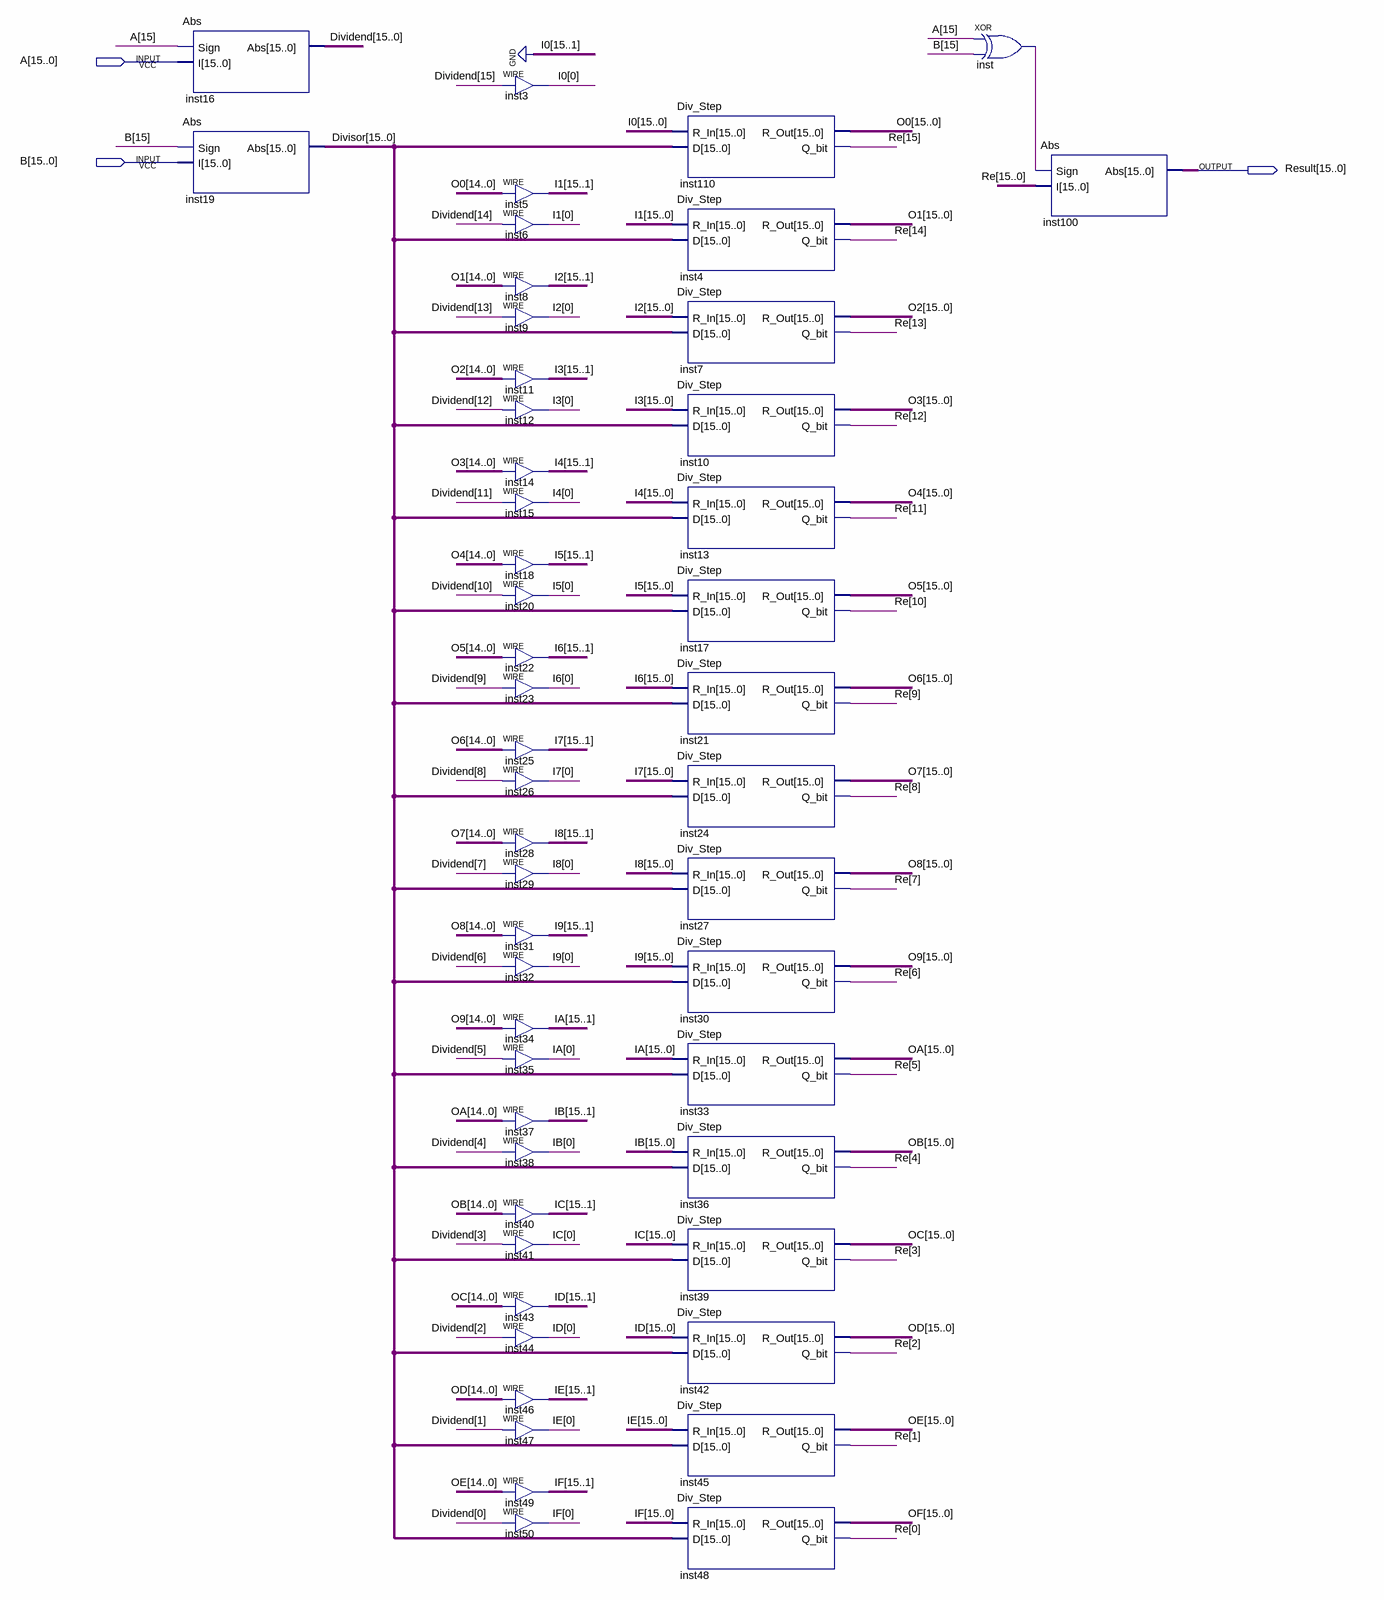
[diagram p0: schematic sheet]
// Quartus schematic Div16.bdf as structural Verilog: 51 symbols, 3 pins
module Div16 (
  input  [15:0] A,
  input  [15:0] B,
  output [15:0] Result
);

  wire inst_out;
  wire [0:0] I0;
  wire [15:0] Dividend, Divisor, I1, I2, I3, I4, I5, I6, I7, I8, I9, IA, IB, IC, ID, IE, IF, O0, O1, O2, O3,
       O4, O5, O6, O7, O8, O9, OA, OB, OC, OD, OE, OF, Re;

  Abs inst16 (.Sign(A[15]), .I(A), .Abs(Dividend));
  Abs inst19 (.Sign(B[15]), .I(B), .Abs(Divisor));
  assign I0[0] = Dividend[15];  // WIRE inst3
  assign I1[15:1] = O0[14:0];  // WIRE inst5
  assign I1[0] = Dividend[14];  // WIRE inst6
  assign I2[15:1] = O1[14:0];  // WIRE inst8
  assign I2[0] = Dividend[13];  // WIRE inst9
  assign I3[15:1] = O2[14:0];  // WIRE inst11
  assign I3[0] = Dividend[12];  // WIRE inst12
  assign I4[15:1] = O3[14:0];  // WIRE inst14
  assign I4[0] = Dividend[11];  // WIRE inst15
  assign I5[15:1] = O4[14:0];  // WIRE inst18
  assign I5[0] = Dividend[10];  // WIRE inst20
  assign I6[15:1] = O5[14:0];  // WIRE inst22
  assign I6[0] = Dividend[9];  // WIRE inst23
  assign I7[15:1] = O6[14:0];  // WIRE inst25
  assign I7[0] = Dividend[8];  // WIRE inst26
  assign I8[15:1] = O7[14:0];  // WIRE inst28
  assign I8[0] = Dividend[7];  // WIRE inst29
  assign I9[15:1] = O8[14:0];  // WIRE inst31
  assign I9[0] = Dividend[6];  // WIRE inst32
  assign IA[15:1] = O9[14:0];  // WIRE inst34
  assign IA[0] = Dividend[5];  // WIRE inst35
  assign IB[15:1] = OA[14:0];  // WIRE inst37
  assign IB[0] = Dividend[4];  // WIRE inst38
  assign IC[15:1] = OB[14:0];  // WIRE inst40
  assign IC[0] = Dividend[3];  // WIRE inst41
  assign ID[15:1] = OC[14:0];  // WIRE inst43
  assign ID[0] = Dividend[2];  // WIRE inst44
  assign IE[15:1] = OD[14:0];  // WIRE inst46
  assign IE[0] = Dividend[1];  // WIRE inst47
  assign IF[15:1] = OE[14:0];  // WIRE inst49
  assign IF[0] = Dividend[0];  // WIRE inst50
  Div_Step inst110 (.R_In({{15{1'b0}}, I0[0]}), .D(Divisor), .R_Out(O0), .Q_bit(Re[15]));
  Div_Step inst4 (.R_In(I1), .D(Divisor), .R_Out(O1), .Q_bit(Re[14]));
  Div_Step inst7 (.R_In(I2), .D(Divisor), .R_Out(O2), .Q_bit(Re[13]));
  Div_Step inst10 (.R_In(I3), .D(Divisor), .R_Out(O3), .Q_bit(Re[12]));
  Div_Step inst13 (.R_In(I4), .D(Divisor), .R_Out(O4), .Q_bit(Re[11]));
  Div_Step inst17 (.R_In(I5), .D(Divisor), .R_Out(O5), .Q_bit(Re[10]));
  Div_Step inst21 (.R_In(I6), .D(Divisor), .R_Out(O6), .Q_bit(Re[9]));
  Div_Step inst24 (.R_In(I7), .D(Divisor), .R_Out(O7), .Q_bit(Re[8]));
  Div_Step inst27 (.R_In(I8), .D(Divisor), .R_Out(O8), .Q_bit(Re[7]));
  Div_Step inst30 (.R_In(I9), .D(Divisor), .R_Out(O9), .Q_bit(Re[6]));
  Div_Step inst33 (.R_In(IA), .D(Divisor), .R_Out(OA), .Q_bit(Re[5]));
  Div_Step inst36 (.R_In(IB), .D(Divisor), .R_Out(OB), .Q_bit(Re[4]));
  Div_Step inst39 (.R_In(IC), .D(Divisor), .R_Out(OC), .Q_bit(Re[3]));
  Div_Step inst42 (.R_In(ID), .D(Divisor), .R_Out(OD), .Q_bit(Re[2]));
  Div_Step inst45 (.R_In(IE), .D(Divisor), .R_Out(OE), .Q_bit(Re[1]));
  Div_Step inst48 (.R_In(IF), .D(Divisor), .R_Out(OF), .Q_bit(Re[0]));
  xor inst (inst_out, A[15], B[15]);
  Abs inst100 (.Sign(inst_out), .I(Re), .Abs(Result));
endmodule
